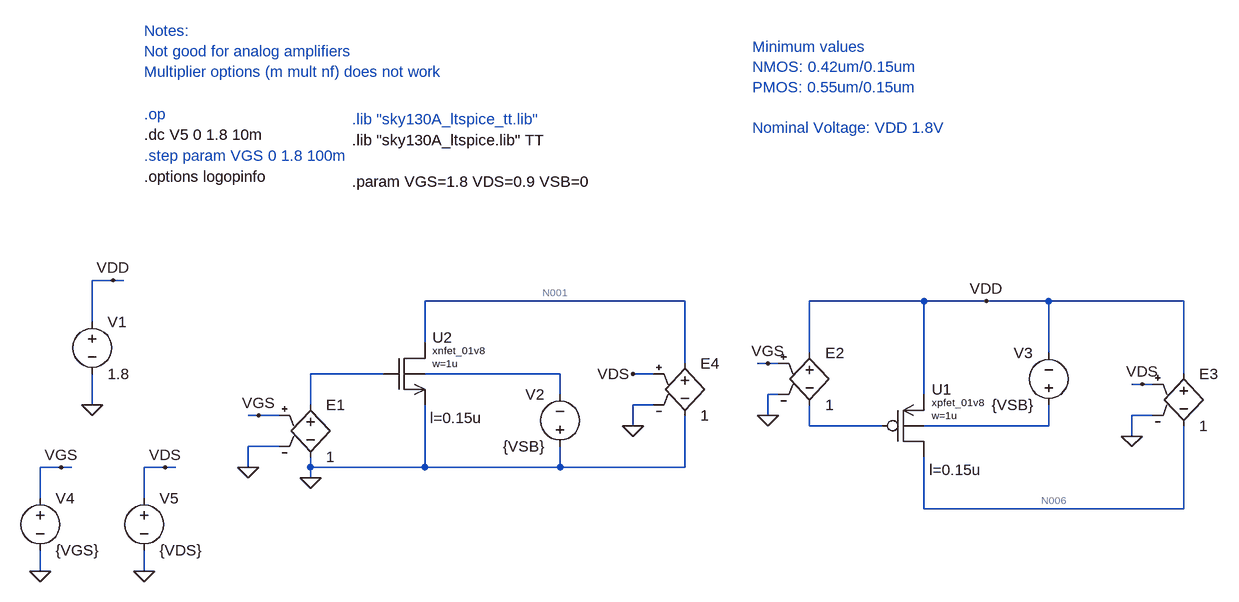
[diagram p0: schematic DC_Sweep.asc]
DC_Sweep.asc, the LTspice schematic file:
Version 4.1
SHEET 1 6080 1492
WIRE 80 -48 48 -48
WIRE 96 -48 80 -48
WIRE 960 -16 560 -16
WIRE 1328 -16 1152 -16
WIRE 1424 -16 1328 -16
WIRE 1520 -16 1424 -16
WIRE 1728 -16 1520 -16
WIRE 48 16 48 -48
WIRE 560 48 560 -16
WIRE 1152 64 1152 -16
WIRE 1520 64 1520 -16
WIRE 960 80 960 -16
WIRE 1088 80 1072 80
WIRE 1104 80 1088 80
WIRE 496 96 384 96
WIRE 768 96 560 96
WIRE 912 96 880 96
WIRE 1728 96 1728 -16
WIRE 1664 112 1648 112
WIRE 1680 112 1664 112
WIRE 768 128 768 96
WIRE 1104 128 1088 128
WIRE 1328 128 1328 -16
WIRE 48 144 48 96
WIRE 384 144 384 96
WIRE 912 144 880 144
WIRE 304 160 288 160
WIRE 336 160 304 160
WIRE 1088 160 1088 128
WIRE 1680 160 1648 160
WIRE 880 176 880 144
WIRE 1152 176 1152 144
WIRE 1264 176 1152 176
WIRE 1520 176 1520 144
WIRE 1520 176 1328 176
WIRE 1648 192 1648 160
WIRE 336 208 288 208
WIRE 0 240 -32 240
WIRE 16 240 0 240
WIRE 160 240 128 240
WIRE 176 240 160 240
WIRE 288 240 288 208
WIRE 384 240 384 224
WIRE 560 240 560 144
WIRE 560 240 384 240
WIRE 768 240 768 208
WIRE 768 240 560 240
WIRE 960 240 960 160
WIRE 960 240 768 240
WIRE 384 256 384 240
WIRE -32 288 -32 240
WIRE 128 288 128 240
WIRE 1328 304 1328 224
WIRE 1728 304 1728 176
WIRE 1728 304 1328 304
WIRE -32 400 -32 368
WIRE 128 400 128 368
FLAG 80 -48 VDD
FLAG 48 144 0
FLAG 384 256 0
FLAG 1424 -16 VDD
FLAG 288 240 0
FLAG 1088 160 0
FLAG -32 400 0
FLAG 0 240 VGS
FLAG 304 160 VGS
FLAG 1088 80 VGS
FLAG 1648 192 0
FLAG 880 176 0
FLAG 1664 112 VDS
FLAG 880 96 VDS
FLAG 128 400 0
FLAG 160 240 VDS
SYMBOL voltage 48 0 R0
WINDOW 123 0 0 Left 0
WINDOW 39 0 0 Left 0
SYMATTR InstName V1
SYMATTR Value 1.8
SYMBOL voltage 768 224 R180
WINDOW 0 24 96 Left 2
WINDOW 3 24 16 Left 2
SYMATTR InstName V2
SYMATTR Value {VSB}
SYMBOL voltage 1520 160 R180
WINDOW 0 24 96 Left 2
WINDOW 3 24 16 Left 2
SYMATTR InstName V3
SYMATTR Value {VSB}
SYMBOL e 384 128 R0
SYMATTR InstName E1
SYMATTR Value 1
SYMBOL e 1152 48 R0
SYMATTR InstName E2
SYMATTR Value 1
SYMBOL voltage -32 272 R0
SYMATTR InstName V4
SYMATTR Value {VGS}
SYMBOL e 1728 80 R0
SYMATTR InstName E3
SYMATTR Value 1
SYMBOL e 960 64 R0
SYMATTR InstName E4
SYMATTR Value 1
SYMBOL voltage 128 272 R0
SYMATTR InstName V5
SYMATTR Value {VDS}
SYMBOL xpch 1280 128 R0
WINDOW 123 56 116 Left 2
SYMATTR Value2 l=0.15u
SYMATTR InstName U1
SYMATTR Value w=1u
SYMATTR SpiceModel xpfet_01v8
SYMBOL xnch 512 48 R0
WINDOW 123 56 116 Left 2
SYMATTR Value2 l=0.15u
SYMATTR InstName U2
SYMATTR Value w=1u
SYMATTR SpiceModel xnfet_01v8
TEXT 128 -304 Left 2 ;.op
TEXT 128 -272 Left 2 !.dc V5 0 1.8 10m
TEXT 128 -432 Left 2 ;Notes:\nNot good for analog amplifiers\nMultiplier options (m mult nf) does not work
TEXT 448 -200 Left 2 !.param VGS=1.8 VDS=0.9 VSB=0
TEXT 128 -240 Left 2 ;.step param VGS 0 1.8 100m
TEXT 1064 -408 Left 2 ;Minimum values\nNMOS: 0.42um/0.15um\nPMOS: 0.55um/0.15um\n \nNominal Voltage: VDD 1.8V
TEXT 128 -208 Left 2 !.options logopinfo
TEXT 448 -296 Left 2 ;.lib "sky130A_ltspice_tt.lib"
TEXT 448 -264 Left 2 !.lib "sky130A_ltspice.lib" TT

The netlist it stands for:
* DC_Sweep.asc
V1 VDD 0 1.8
V2 0 N003 {VSB}
V3 N005 VDD {VSB}
E1 N002 0 VGS 0 1
E2 VDD N004 VGS 0 1
V4 VGS 0 {VGS}
E3 VDD N006 VDS 0 1
E4 N001 0 VDS 0 1
V5 VDS 0 {VDS}
X§U1 N006 N004 VDD N005 xpfet_01v8 w=1u l=0.15u  ; pins D G S B
X§U2 N001 N002 0 N003 xnfet_01v8 w=1u l=0.15u  ; pins D G S B
* .op
.dc V5 0 1.8 10m
* Notes:
* Not good for analog amplifiers
* Multiplier options (m mult nf) does not work
.param VGS=1.8 VDS=0.9 VSB=0
* .step param VGS 0 1.8 100m
* Minimum values
* NMOS: 0.42um/0.15um
* PMOS: 0.55um/0.15um
* Nominal Voltage: VDD 1.8V
.options logopinfo
* .lib "sky130A_ltspice_tt.lib"
.lib "sky130A_ltspice.lib" TT
.backanno
.end

* Results of the author's LTspice run, read from the files saved beside the schematic
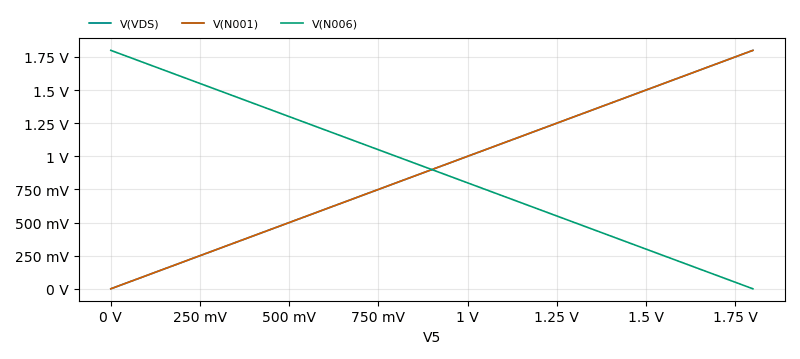
[diagram p1: DC transfer characteristic of DC_Sweep.asc, plotted from the saved traces]
* DC transfer characteristic, 1 run:
*   V(VDS): 0 V at V5=0 V, 1.8 V at V5=1.8 V, min 0 V, max 1.8 V
*   V(N001): 0 V at V5=0 V, 1.8 V at V5=1.8 V, min 0 V, max 1.8 V
*   V(N006): 1.8 V at V5=0 V, 0 V at V5=1.8 V, min 0 V, max 1.8 V